# EAGLE design GeekGatheringIot (EAGLE 7.1.0)
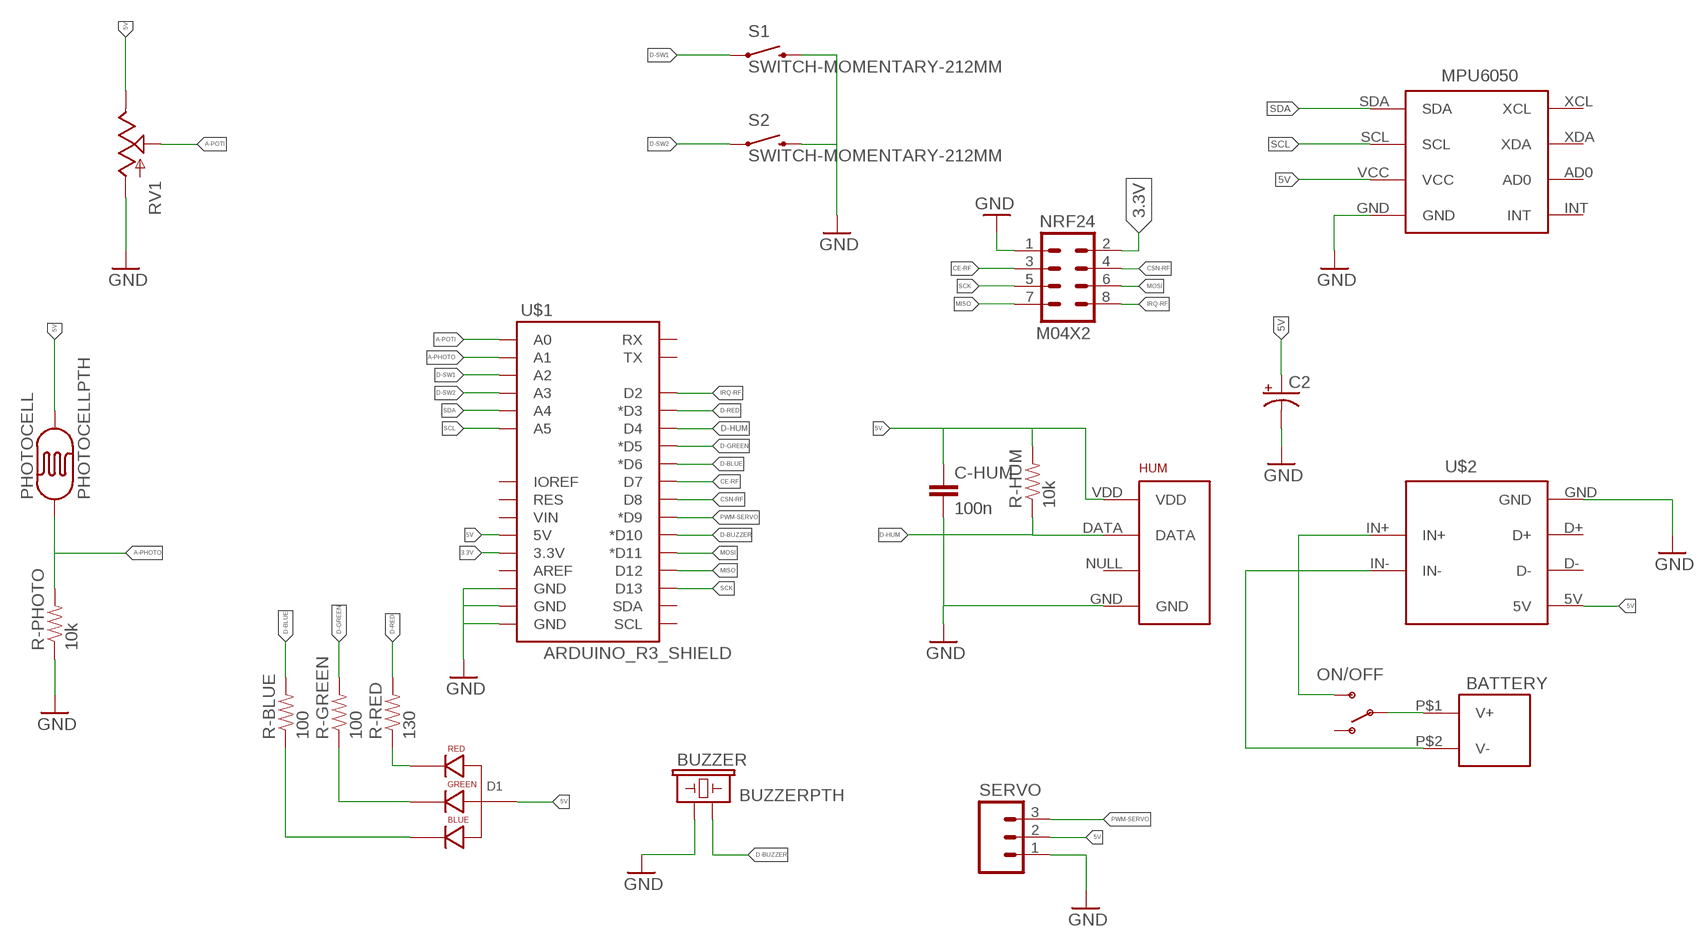
[diagram p0: schematic, sheet 1]

## Parts
BATTERY  BATTERY-PACKAAA  [BATTERY-PACK]
BUZZER  BUZZERPTH  [BUZZER-12MM]
C2  CAP_POLPTH2  [CPOL-RADIAL-10UF-25V]
C-HUM  100n  CAPPTH  [CAP-PTH-SMALL]
D1  LED-RGB-CA-THRUCLEAR  [LED-RGB-THRU]
HUM  RHT03_DHT-22_AM2302  [RHT03_DHT-22]
MPU6050  MPU6050  [MPU6050]
NRF24  M04X2  [2X4]
ON/OFF  SWITCH-SPDTPTH  [SWITCH-SPDT]
PHOTOCELL  PHOTOCELLPTH  [PHOTOCELL]
R-BLUE  100  RESISTORPTH-1/2W  [AXIAL-0.5]
R-GREEN  100  RESISTORPTH-1/2W  [AXIAL-0.5]
R-HUM  10k  RESISTORPTH-1/2W  [AXIAL-0.5]
R-PHOTO  10k  RESISTORPTH-1/2W  [AXIAL-0.5]
R-RED  130  RESISTORPTH-1/2W  [AXIAL-0.5]
RV1  POT-RV16AF-20  [POT_ALPHA_RV16AF-20]
S1  SWITCH-MOMENTARY-212MM  [TACTILE-PTH-12MM]
S2  SWITCH-MOMENTARY-212MM  [TACTILE-PTH-12MM]
SERVO  M03PTH  [1X03]
U$1  ARDUINO_R3_SHIELD  [UNO_R3_SHIELD]
U$2  DC-DC-5V  [DC-DC-5V]

## Nets
3.3V: NRF24.2 U$1.3.3V
5V: C2.1(+) C-HUM.1 D1.2(ANODE) HUM.VDD MPU6050.VCC PHOTOCELL.2 R-HUM.P$2 RV1.3(E) SERVO.2 U$1.5V U$2.5V
A-PHOTO: PHOTOCELL.1 R-PHOTO.P$2 U$1.A1
A-POTI: RV1.2(S) U$1.A0
CE-RF: NRF24.3 U$1.D7
CSN-RF: NRF24.4 U$1.D8
D-BLUE: R-BLUE.P$2 U$1.D6(*D6)
D-BUZZER: BUZZER.- U$1.D10(*D10)
D-GREEN: R-GREEN.P$2 U$1.D5(*D5)
D-HUM: HUM.DATA R-HUM.P$1 U$1.D4
D-RED: R-RED.P$2 U$1.D3(*D3)
D-SW1: S1.1 U$1.A2
D-SW2: S2.1 U$1.A3
GND: BUZZER.+ C2.2(-) C-HUM.2 HUM.GND MPU6050.GND NRF24.1 R-PHOTO.P$1 RV1.1(A) S1.3 S2.3 SERVO.1 U$1.GND@0(GND) U$1.GND@1(GND) U$1.GND@2(GND) U$2.GND
IRQ-RF: NRF24.8 U$1.D2
MISO: NRF24.7 U$1.D12
MOSI: NRF24.6 U$1.D11(*D11)
N$1: D1.1(RED_CATHODE) R-RED.P$1
N$2: D1.3(GREEN_CATHODE) R-GREEN.P$1
N$3: D1.4(BLUE_CATHODE) R-BLUE.P$1
N$4: BATTERY.P$1(V+) ON/OFF.2(P)
N$5: BATTERY.P$2(V-) U$2.IN-
N$6: ON/OFF.3(S) U$2.IN+
PWM-SERVO: SERVO.3 U$1.D9(*D9)
SCK: NRF24.5 U$1.D13
SCL: MPU6050.SCL U$1.A5
SDA: MPU6050.SDA U$1.A4
Unconnected: HUM.NULL MPU6050.AD0 MPU6050.INT MPU6050.XCL MPU6050.XDA ON/OFF.1(O) U$1.AREF U$1.IOREF U$1.RES U$1.RX U$1.SCL U$1.SDA U$1.TX U$1.VIN U$2.D+ U$2.D-

## Library data of the parts
BATTERY = BtParts:BATTERY-PACK
BUZZER = SparkFun-Electromechanical:BUZZER: Buzzer 12mm Spark Fun Electronics SKU : Comp-Buzzer
C2 = SparkFun-Capacitors:CAP_POL: Capacitor Polarized These are standard SMD and PTH capacitors. Normally 10uF, 47uF, and 100uF in electrolytic and tantalum varieties. Always verify the external diameter of the through hole cap, it varies with capacity, voltage, and manufacturer. The EIA devices should be standard.
C-HUM = SparkFun-Capacitors:CAP: Capacitor Standard 0603 ceramic capacitor, and 0.1" leaded capacitor.
D1 = SparkFun-LED:LED-RGB-CA-THRU: RGB Through-hole common anode SparkFun store front COM-10821 (diffuse) COM-10820 (clear); PROD_ID: DIO-10631
HUM = RHT03_DHT-22_AM2302:RHT03_DHT-22_AM2302: RHT03 / DHT-22 / AM2302 Packages and symbol for the RHT03 / DHT-22 relative humidity and temperature sensor. Note: The AM2302 is a wired version of the DHT-22 which typically requires less clearance and is thus provided as a separate package.; PROD_ID: SEN-10167
MPU6050 = BtParts:MPU6050
NRF24 = SparkFun-Connectors:M04X2: .1" header, two rows of four.
ON/OFF = SparkFun-Electromechanical:SWITCH-SPDT: SPDT Switch Simple slide switch, Spark Fun Electronics SKU : COM-00102 DPDT SMT slide switch, AYZ0202, SWCH-08179
PHOTOCELL = SparkFun-Sensors:PHOTOCELL: CdS photoresistor. This is a low cost way to detect light levels. Resistance decreases with more incoming light. SparkFun SKU: SEN-09088
R-BLUE R-GREEN R-HUM R-PHOTO R-RED = SparkFun-Resistors:RESISTOR: Resistor Basic schematic elements and footprints for 0603, 1206, and PTH resistors.
RV1 = SparkFun-Electromechanical:POT
S1 S2 = SparkFun-Electromechanical:SWITCH-MOMENTARY-2: Various NO switches- pushbuttons, reed, etc; PROD_ID: SWCH-09185
SERVO = SparkFun-Connectors:M03: Header 3 Standard 3-pin 0.1" header. Use with straight break away headers (SKU : PRT-00116), right angle break away headers (PRT-00553), swiss pins (PRT-00743), machine pins (PRT-00117), and female headers (PRT-00115). Molex polarized connector foot print use with SKU : PRT-08232 with associated crimp pins and housings.
U$1 = SparkFun-Boards:ARDUINO_R3_SHIELD: Shield form compatible with the Arduino Uno R3.
U$2 = BtParts:DC-DC-5V

## Net classes
0 default: width 0.305 mm, drill 0.508 mm, clearance 0.254 mm

## Board
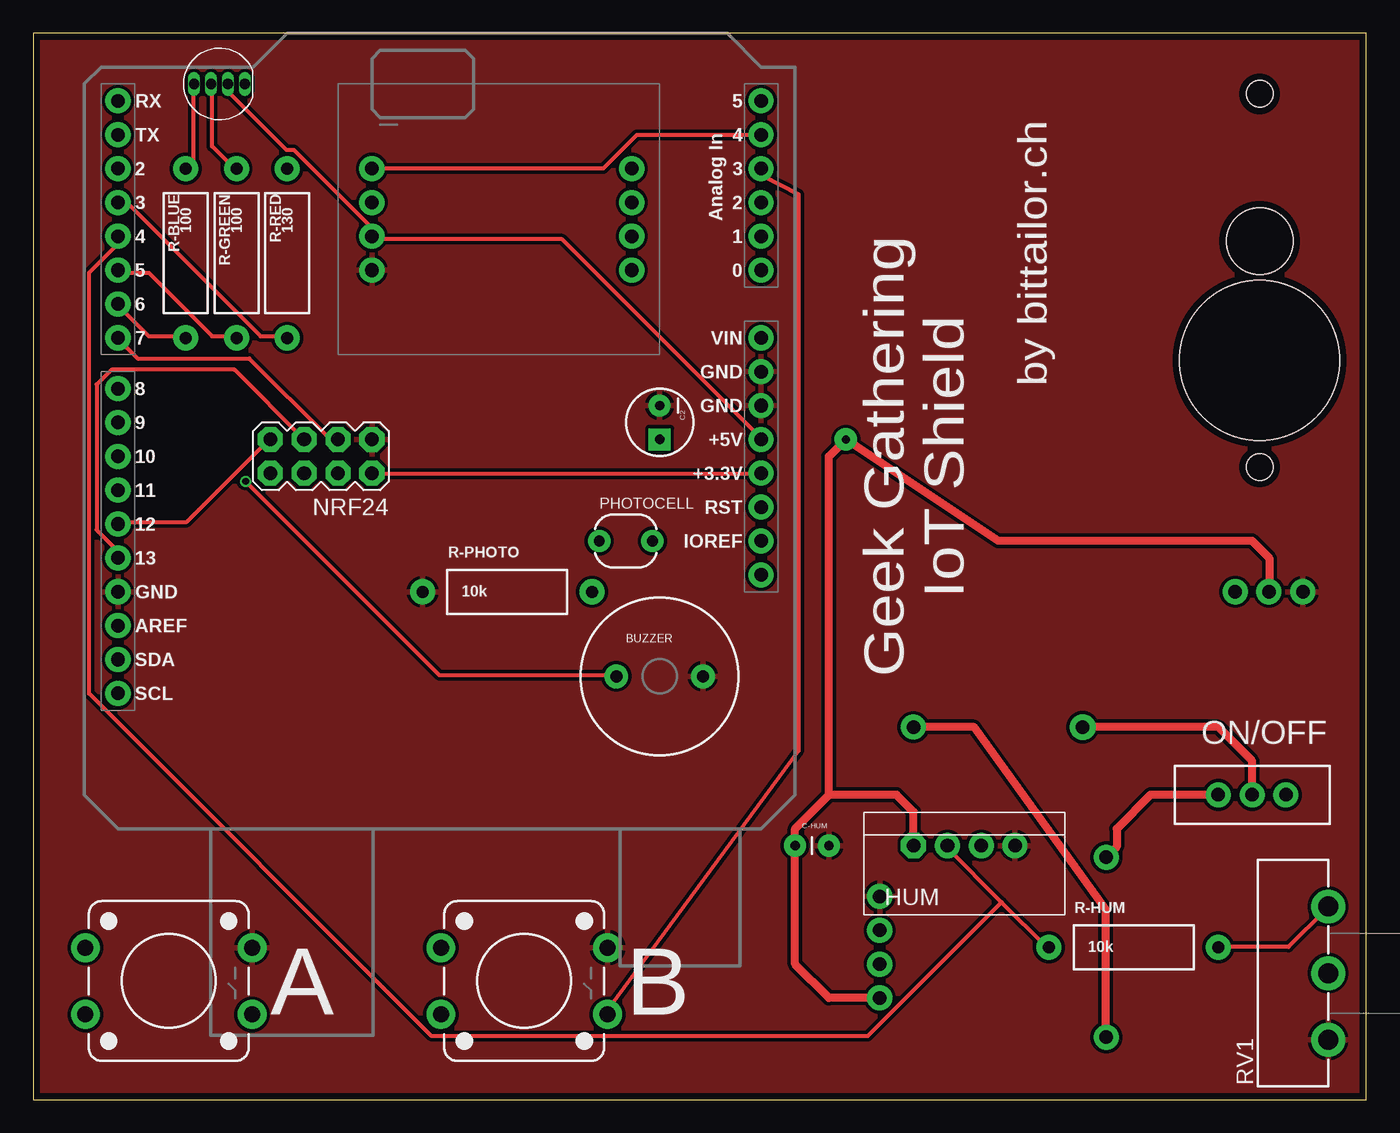
[diagram p1: board, top side]
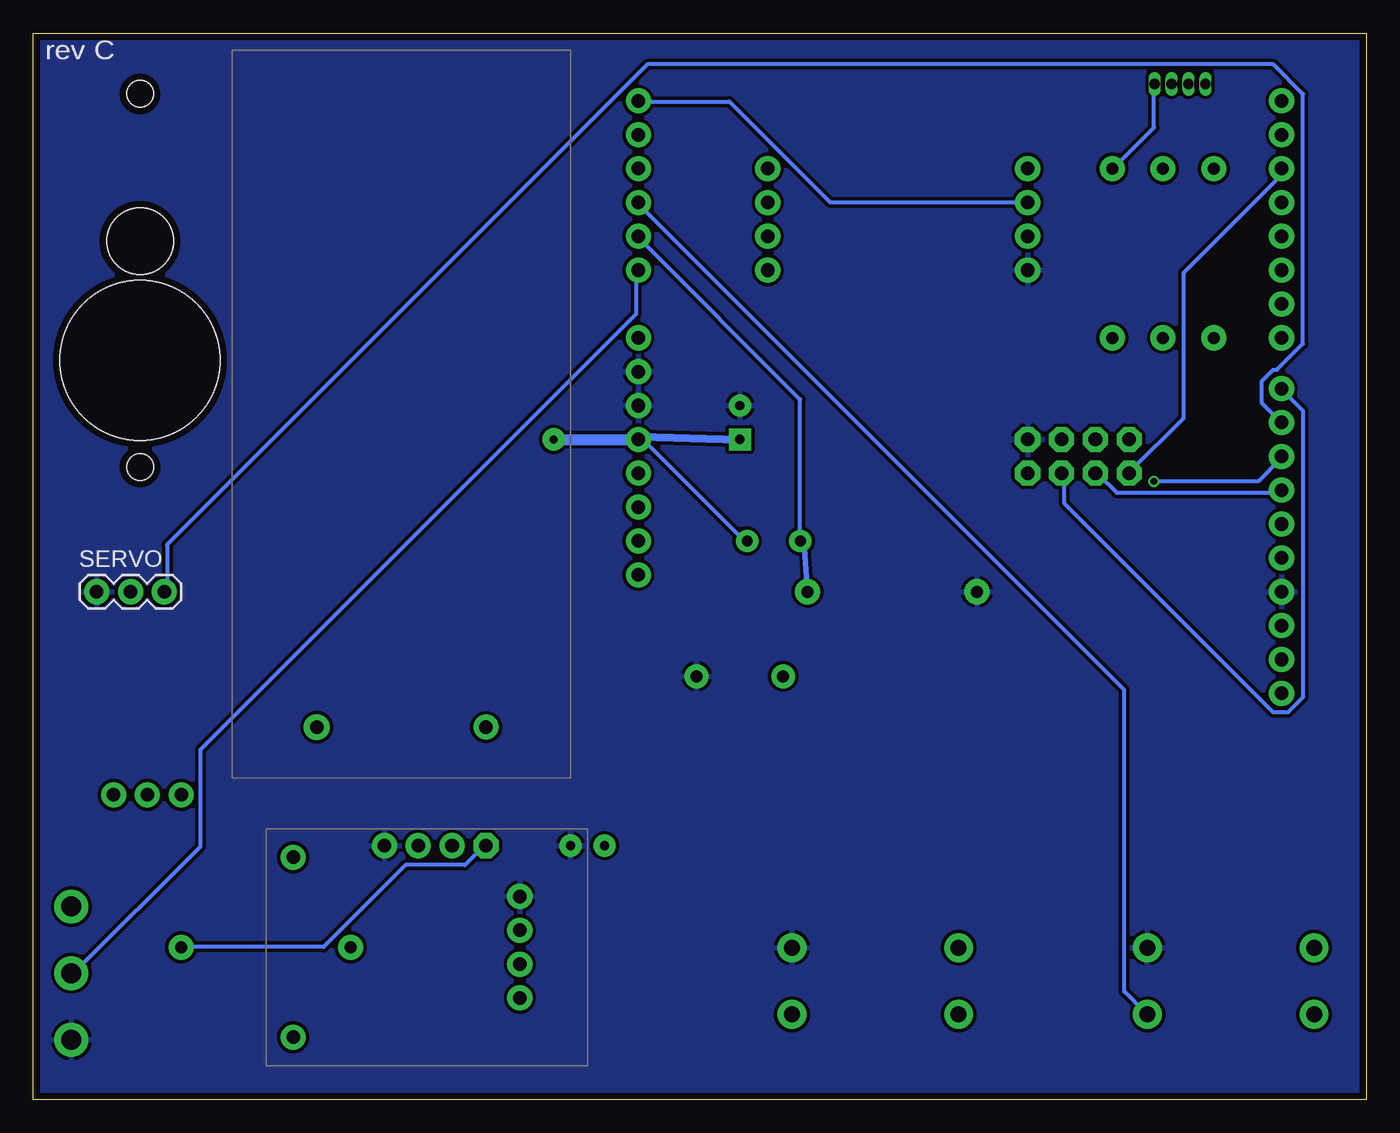
[diagram p2: board, bottom side, seen from below]

Size 100 x 80 mm. Coordinates in mm from the lower left corner, seen from the top.
Outline: 0,0 100,0 100,80 0,80 0,0
Copper layers (1*16): Top 0.035mm / dielectric 1.5mm / Bottom 0.035mm
Design rules "EagleRules *": minimum track width 7mil, minimum drill 12mil, track to track 7mil, track to pad 7mil, pad to pad 7mil, via to via 7mil, smd to smd 0mil, copper to edge 20mil, drill to drill 10mil, minimum pad ring 0mil, minimum via ring 6mil, stop-mask expansion 2mil, vias tented up to drill 25mil, thermal gap 10mil
Holes 2 mm at 92,47.45 92,75.45
Holes 12 mm at 92,55.45
Holes 5 mm at 92,64.4

### Footprints (pad centres in the part's own frame; a part is rotated, then mirrored left to right if it is on the bottom)
BATTERY-PACK = drill 1.016 pad 1.93: P$1 0,6.35 | drill 1.016 pad 1.88: P$2 0,-6.35
BUZZER-12MM = drill 0.9 pad 1.778: + 3.25,0; - -3.25,0
CPOL-RADIAL-10UF-25V = drill 0.7 pad 1.651 square: 1 1.27,0 | drill 0.7 pad 1.651: 2 -1.27,0
CAP-PTH-SMALL = drill 0.7 pad 1.651: 1 0,0; 2 2.54,0
LED-RGB-THRU = drill 0.762 pad 0.889 long: 1 1.905,0; 2 0.635,0; 3 -0.635,0; 4 -1.905,0
RHT03_DHT-22 = drill 1.016 pad 1.88: DATA -1.27,0; GND 3.81,0; NULL 1.27,0 | drill 1.016 pad 1.88 octagon: VDD -3.81,0
MPU6050 = drill 1.016 pad 1.88: AD0 19.5,-2.54; GND 0,-5.08; INT 19.5,-5.08; SCL 0,0; SDA 0,2.54; VCC 0,-2.54; XCL 19.5,2.54; XDA 19.5,0
2X4 = drill 1.016 pad 1.88 octagon: 1 -3.81,-1.27; 2 -3.81,1.27; 3 -1.27,-1.27; 4 -1.27,1.27; 5 1.27,-1.27; 6 1.27,1.27; 7 3.81,-1.27; 8 3.81,1.27
SWITCH-SPDT = drill 1.016 pad 1.88: 1 0,2.54; 2 0,0; 3 0,-2.54
PHOTOCELL = drill 0.8 pad 1.676: 1 -2,0; 2 2,0
AXIAL-0.5 = drill 0.9 pad 1.88: P$1 -6.35,0; P$2 6.35,0
POT_ALPHA_RV16AF-20 = drill 1.5 pad 2.54: 1 -5,0; 2 0,0; 3 5,0
TACTILE-PTH-12MM = drill 1.2 pad 2.159: 1 6.25,-2.5; 2 -6.25,-2.5; 3 6.25,2.5; 4 -6.25,2.5
1X03 = drill 1.016 pad 1.88: 1 0,0; 2 2.54,0; 3 5.08,0
UNO_R3_SHIELD = drill 1.016 pad 1.88: 3.3V 50.8,26.67; 5V 50.8,29.21; A0 50.8,41.91; A1 50.8,44.45; A2 50.8,46.99; A3 50.8,49.53; A4 50.8,52.07; A5 50.8,54.61; AREF 2.54,15.24; D2 2.54,49.53; D3 2.54,46.99; D4 2.54,44.45; D5 2.54,41.91; D6 2.54,39.37; D7 2.54,36.83; D8 2.54,33.02; D9 2.54,30.48; D10 2.54,27.94; D11 2.54,25.4; D12 2.54,22.86; D13 2.54,20.32; GND@0 50.8,31.75; GND@1 50.8,34.29; GND@2 2.54,17.78; IOREF 50.8,21.59; NC 50.8,19.05; RES 50.8,24.13; RX 2.54,54.61; SCL 2.54,10.16; SDA 2.54,12.7; TX 2.54,52.07; VIN 50.8,36.83
DC-DC-5V = drill 1.016 pad 1.88: 5V 6.35,-3.81; D+ 6.35,1.27; D- 6.35,-1.27; GND 6.35,3.81; IN+ -10.65,6.75; IN- -10.65,-6.75

### Placement (x,y rotation side)
BATTERY  72.39,27.94 90 bottom
BUZZER  46.99,31.75 0 top
C2  46.99,50.8 270 top
C-HUM  57.15,19.05 0 top
D1  13.97,76.2 0 top
HUM  69.85,19.05 0 top
MPU6050  25.4,67.31 0 top
NRF24  21.59,48.26 180 top
ON/OFF  91.44,22.86 270 top
PHOTOCELL  44.45,41.91 0 top
R-BLUE  11.43,63.5 270 top
R-GREEN  15.24,63.5 270 top
R-HUM  82.55,11.43 0 top
R-PHOTO  35.56,38.1 0 top
R-RED  19.05,63.5 270 top
RV1  97.15,9.48 90 top
S1  10.16,8.89 0 top
S2  36.83,8.89 0 top
SERVO  95.25,38.1 0 bottom
U$1  3.81,20.32 0 top
U$2  69.85,11.43 0 bottom

### Tracks (layer width: path | path; a pad name or v marks a point on that pad's centre or on a via)
3.3V
  Top 0.305: NRF24.2 25.43,46.94 54.48,46.94 U$1.3.3V
5V  (via drill 0.6 pad 1.68)
  Top 0.305: R-HUM.P$2 89.13,11.46 94.16,11.46 96.95,14.25 RV1.3 96.95,14.53 | 92.76,38 SERVO.2 | D1.2 14.81,76 14.81,75.44 19,71.25 19.56,71.25 25.15,65.66 25.15,64.82 MPU6050.VCC 25.43,64.54 39.67,64.54 54.48,49.73 U$1.5V
  Top 0.61: 92.76,38 92.76,40.59 91.44,41.91 72.39,41.91 v60.96,49.53 59.69,48.26 59.69,22.86 | U$2.5V 59.69,7.62 57.15,10.16 C-HUM.1 57.15,20.32 59.69,22.86 | HUM.VDD 66.04,21.59 64.77,22.86 59.69,22.86
  Bottom 0.305: U$1.5V 54.48,49.73 46.66,41.91 PHOTOCELL.2 | 57,19.28 C-HUM.1 | R-HUM.P$2 88.85,11.46 78.23,11.46 72.08,17.6 67.61,17.6 66.22,19 HUM.VDD
  Bottom 0.61: 54.48,49.73 C2.1
  Bottom 0.813: v60.96,49.53 U$1.5V
A-PHOTO
  Bottom 0.305: 42.19,41.91 PHOTOCELL.1 42.47,41.91 42.47,52.53 54.48,64.54 U$1.A1
  Bottom 0.406: 42.19,41.91 R-PHOTO.P$2
A-POTI
  Bottom 0.305: U$1.A0 54.76,62.03 54.76,58.95 87.45,26.26 87.45,19 96.95,9.5 RV1.2
CE-RF
  Top 0.305: NRF24.3 22.63,49.73 22.07,49.73 16.2,55.6 7.82,55.6 6.43,57 U$1.D7
CSN-RF
  Bottom 0.305: NRF24.4 22.63,46.94 22.63,44.7 6.99,29.06 5.87,29.06 4.75,30.18 4.75,51.69 6.15,53.09 U$1.D8
D-BLUE
  Top 0.305: R-BLUE.P$2 11.18,57.28 8.66,57.28 6.43,59.51 U$1.D6
D-BUZZER  (via drill 0.51)
  Top 0.305: v15.93,46.38 30.45,31.85 43.59,31.85 BUZZER.-
  Bottom 0.305: v15.93,46.38 8.1,46.38 6.43,48.06 U$1.D10
D-GREEN
  Top 0.305: R-GREEN.P$2 15.09,57.28 13.41,57.28 8.66,62.03 6.43,62.03 U$1.D5
D-HUM
  Top 0.305: 72.64,14.81 68.45,19 HUM.DATA | 72.64,14.81 76,11.46 R-HUM.P$1 | 72.64,14.81 62.59,4.75 29.9,4.75 4.19,30.45 4.19,62.03 6.15,63.98 6.15,64.54 U$1.D4
D-RED
  Top 0.305: R-RED.P$2 19,57.28 17.04,57.28 7.26,67.06 6.43,67.06 U$1.D3
D-SW1
  Bottom 0.305: U$1.A2 54.48,67.06 18.16,30.73 18.16,8.1 16.48,6.43 S1.1
D-SW2
  Top 0.305: U$1.A3 54.76,69.85 54.76,69.29 57.43,67.89 57.43,26.19 43.31,6.99 43.31,6.43 S2.1
GND
  pour Top: -1.27,81.28 101.6,81.28 101.6,-1.27 -1.27,-1.27
  pour Bottom: -1.27,81.28 -1.27,-1.27 101.6,-1.27 101.6,81.28
IRQ-RF
  Bottom 0.305: U$1.D2 6.43,69.85 6.43,69.29 13.69,62.03 13.69,51.13 17.6,47.22 NRF24.8
MISO
  Top 0.305: U$1.D12 6.43,43.31 11.46,43.31 17.6,49.45 NRF24.7
MOSI
  Bottom 0.305: U$1.D11 6.43,45.54 18.72,45.54 20.12,46.94 NRF24.6
N$1
  Bottom 0.305: D1.1 15.93,76 15.93,72.92 19,69.85 R-RED.P$1
N$2
  Top 0.305: D1.3 13.41,76 13.41,71.53 15.09,69.85 R-GREEN.P$1
N$3
  Top 0.305: D1.4 12.01,76 12.01,70.41 11.46,69.85 R-BLUE.P$1
N$4
  Top 0.61: ON/OFF.2 91.44,25.4 88.9,27.94 BATTERY.P$1
N$5
  Top 0.305: 80.47,4.75 U$2.IN-
  Top 0.61: BATTERY.P$2 70.59,27.94 80.47,14.25 80.47,4.75
N$6
  Top 0.61: ON/OFF.3 83.82,22.86 81.28,20.32 81.28,18.96 U$2.IN+
PWM-SERVO
  Bottom 0.305: SERVO.3 89.97,38.28 89.97,41.63 53.92,77.67 6.99,77.67 4.75,75.44 4.75,56.72 6.71,54.76 6.99,54.76 7.82,53.92 7.82,52.25 6.43,50.85 U$1.D9
SCK
  Top 0.305: NRF24.5 15.09,54.76 5.87,54.76 4.75,53.65 4.75,42.75 6.15,41.35 6.15,40.79 U$1.D13
SCL
  Bottom 0.305: MPU6050.SCL 25.43,67.33 40.23,67.33 47.78,74.88 54.48,74.88 U$1.A5
SDA
  Top 0.305: MPU6050.SDA 42.75,69.85 45.26,72.36 54.48,72.36 U$1.A4

### Text on the board
tNames: by bittailor.ch | Geek Gathering / IoT Shield | A | B
bNames: rev C